# EAGLE design Indicator_voltage_TNN_V1.0 (EAGLE 9.6.2)
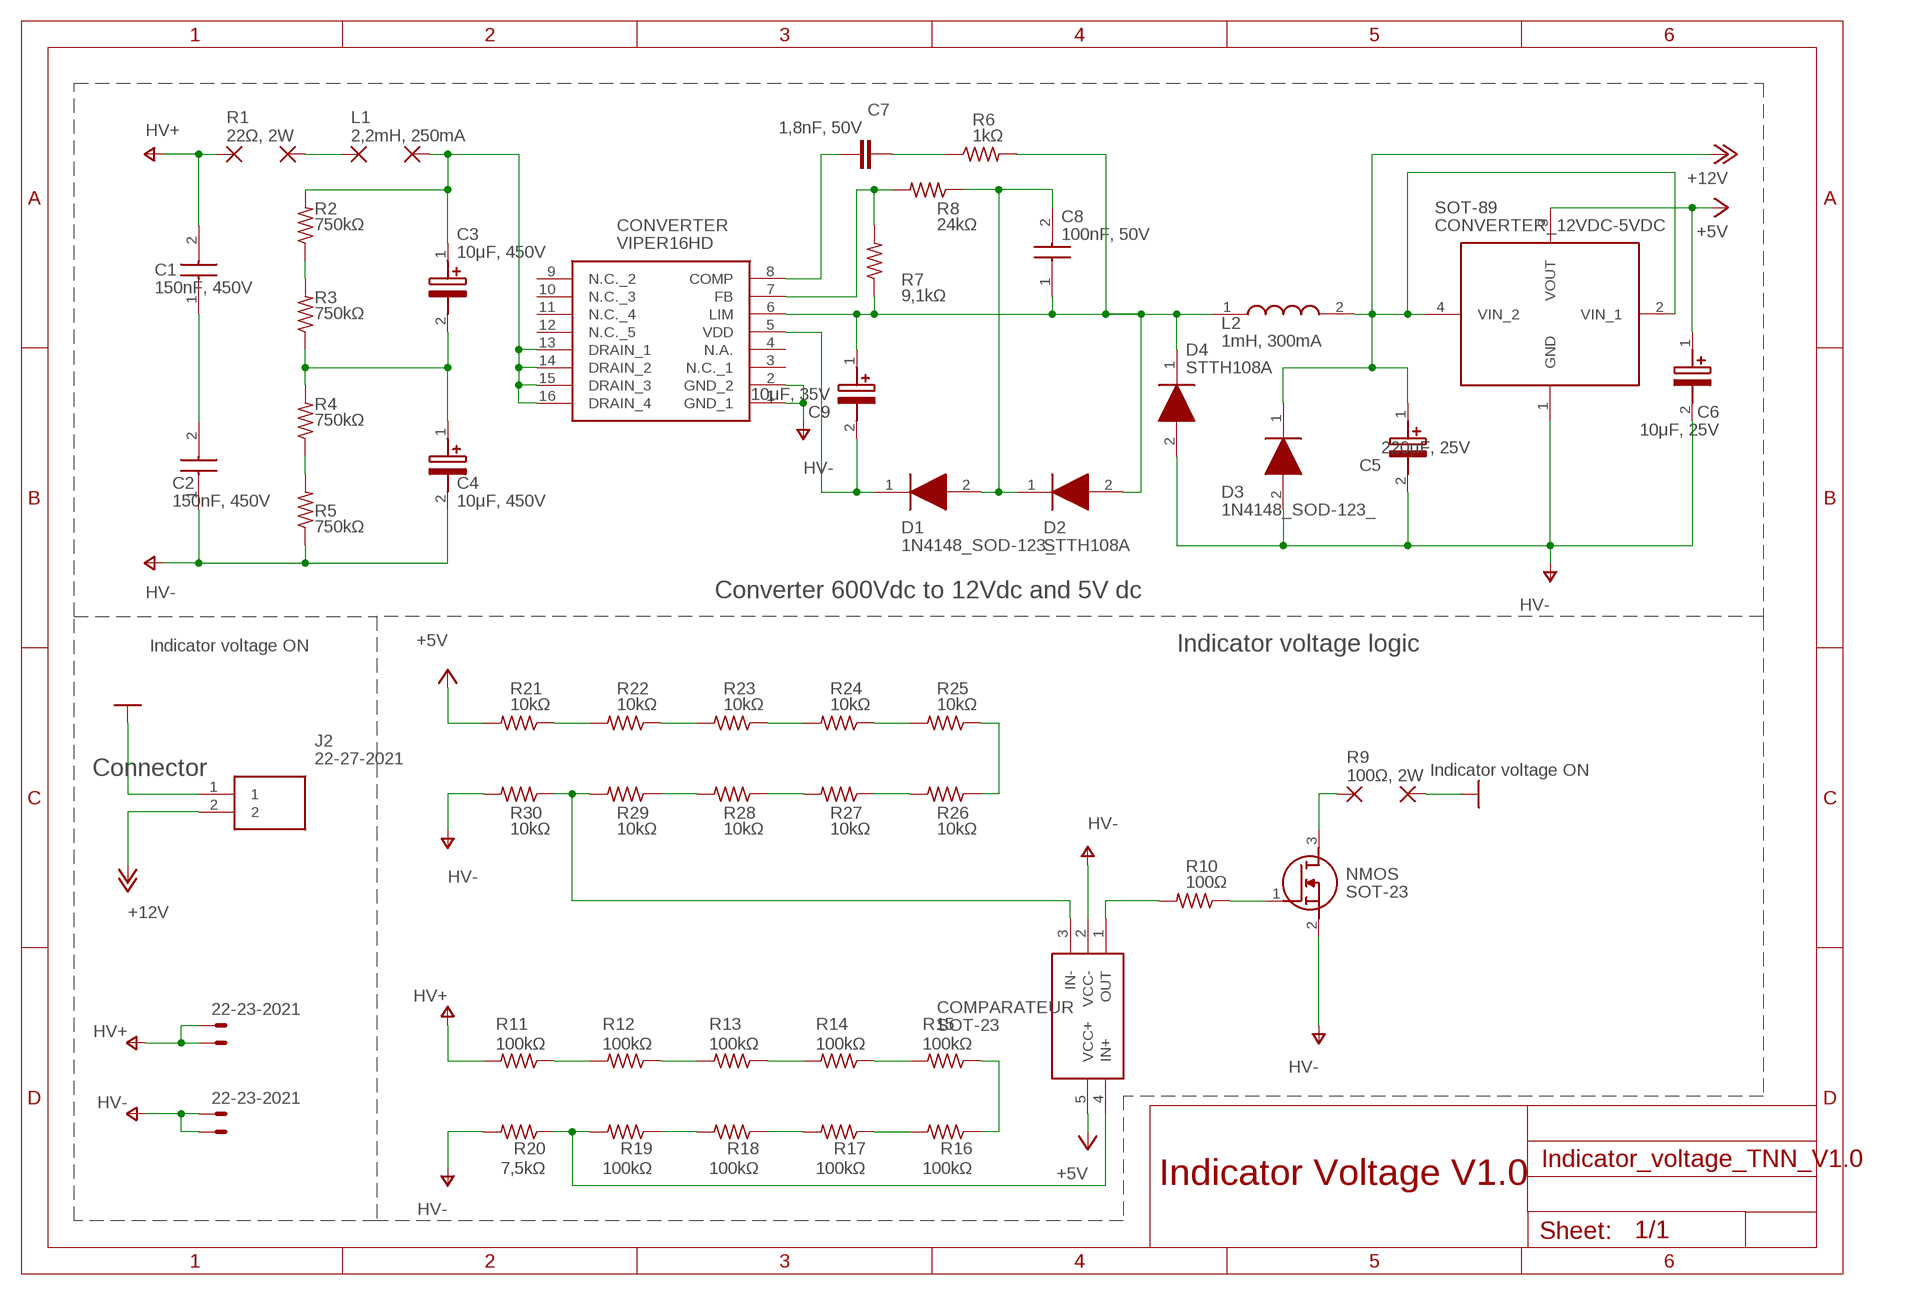
[diagram p0: schematic, sheet 1]

## Parts
C1  150nF, 450V  C1808W154KCRACTU  [CAPC4720X175N]
C2  150nF, 450V  C1808W154KCRACTU  [CAPC4720X175N]
C3  10μF, 450V  7112129  [CAPPRD500W60D1300H2250]
C4  10μF, 450V  7112129  [CAPPRD500W60D1300H2250]
C5  220μF, 25V  7112129  [CAPPRD500W60D1300H2250]
C6  10μF, 25V  ECA1VM100  [CAPPRD200W55D525H1200]
C7  1,8nF, 50V  C-EUC0805  [C0805]
C8  100nF, 50V  C0805C104K5RACTU  [CAPC2012X88N]
C9  10μF, 35V  ECA1VM100  [CAPPRD200W55D525H1200]
COMPARATEUR  SOT-23  TS391IYLT  [SOT95P280X145-5N]
CONVERTER  VIPER16HD  [SOIC127P600X175-16N]
CONVERTER_12VDC-5VDC  SOT-89  LDK320ADU120R  [ST-SOT-89]
D1  1N4148_SOD-123_  [SOD3716X135N]
D2  STTH108A  [DIOM5126X265N]
D3  1N4148_SOD-123_  [SOD3716X135N]
D4  STTH108A  [DIOM5126X265N]
HV+  22-23-2021  [22-23-2021]
HV-  22-23-2021  [22-23-2021]
J2  22-27-2021  [SHDR2W64P0X254_1X2_508X580X117]
L1  2,2mH, 250mA  1,6/0,8  [1,6/0,8]
L2  1mH, 300mA  RLB0914-102KL  [RLB0914]
L3  2,2mH, 250mA  1,6/0,8  [1,6/0,8]
NMOS  SOT-23  DMN2041L-7  [SOT96P240X110-3N]
PAD2  1,6/0,8  [1,6/0,8]
PAD4  1,6/0,8  [1,6/0,8]
R1  22Ω, 2W  1,6/0,8  [1,6/0,8]
R2  750kΩ  R-US_M3216  [M3216]
R3  750kΩ  R-US_M3216  [M3216]
R4  750kΩ  R-US_M3216  [M3216]
R5  750kΩ  R-US_M3216  [M3216]
R6  1kΩ  R-US_M2012  [M2012]
R7  9,1kΩ  R-US_M2012  [M2012]
R8  24kΩ  R-US_M2012  [M2012]
R9  100Ω, 2W  1,6/0,8  [1,6/0,8]
R10  100Ω  R-US_R0603  [R0603]
R11  100kΩ  R-US_R0603  [R0603]
R12  100kΩ  R-US_R0603  [R0603]
R13  100kΩ  R-US_R0603  [R0603]
R14  100kΩ  R-US_R0603  [R0603]
R15  100kΩ  R-US_R0603  [R0603]
R16  100kΩ  R-US_R0603  [R0603]
R17  100kΩ  R-US_R0603  [R0603]
R18  100kΩ  R-US_R0603  [R0603]
R19  100kΩ  R-US_R0603  [R0603]
R20  7,5kΩ  R-US_R0603  [R0603]
R21  10kΩ  R-US_R0603  [R0603]
R22  10kΩ  R-US_R0603  [R0603]
R23  10kΩ  R-US_R0603  [R0603]
R24  10kΩ  R-US_R0603  [R0603]
R25  10kΩ  R-US_R0603  [R0603]
R26  10kΩ  R-US_R0603  [R0603]
R27  10kΩ  R-US_R0603  [R0603]
R28  10kΩ  R-US_R0603  [R0603]
R29  10kΩ  R-US_R0603  [R0603]
R30  10kΩ  R-US_R0603  [R0603]

## Nets
0V: J2.1 PAD4.1(P) ; supply symbol labelled Indicator voltage ON
+5V: C6.1(+) COMPARATEUR.5(VCC+) CONVERTER_12VDC-5VDC.3(VOUT) R21.2
+12V: C5.1(+) CONVERTER_12VDC-5VDC.2(VIN_1) CONVERTER_12VDC-5VDC.4(VIN_2) D3.1(K) J2.2 L2.2
N$1: R11.1 R12.2
N$2: L1.1(P) PAD2.1(P)
N$3: C9.2(-) CONVERTER.5(VDD) D1.1(K)
N$4: C1.1 C2.2
N$5: C3.1(+) CONVERTER.13(DRAIN_1) CONVERTER.14(DRAIN_2) CONVERTER.15(DRAIN_3) CONVERTER.16(DRAIN_4) L3.1(P) R2.2
N$6: R4.1 R5.2
N$7: C3.2(-) C4.1(+) R3.1 R4.2
N$8: R2.1 R3.2
N$9: C7.2 CONVERTER.8(COMP)
N$10: C7.1 R6.1
N$11: C8.1 C9.1(+) CONVERTER.6(LIM) D2.2(A) D4.1(K) L2.1 R6.2 R7.1
N$12: C8.2 D1.2(A) D2.1(K) R8.1
N$13: R12.1 R13.2
N$14: CONVERTER.7(FB) R7.2 R8.2
N$15: R13.1 R14.2
N$16: R14.1 R15.2
N$17: R15.1 R16.1
N$18: R16.2 R17.1
N$19: R17.2 R18.1
N$20: R18.2 R19.1
N$21: COMPARATEUR.4(IN+) R19.2 R20.1
N$22: COMPARATEUR.1(OUT) R10.2
N$23: R21.1 R22.2
N$24: R22.1 R23.2
N$25: R23.1 R24.2
N$26: R24.1 R25.2
N$27: R25.1 R26.1
N$28: R26.2 R27.1
N$29: R27.2 R28.1
N$30: R28.2 R29.1
N$31: COMPARATEUR.3(IN-) R29.2 R30.1
N$32: NMOS.3(D) R9.1(P)
N$33: NMOS.1(G) R10.1
V+: C1.2 HV+.1 HV+.2 R1.1(P) R11.2 ; supply symbol labelled HV+
V-: C2.1 C4.2(-) C5.2(-) C6.2(-) COMPARATEUR.2(VCC-) CONVERTER.1(GND_1) CONVERTER.2(GND_2) CONVERTER_12VDC-5VDC.1(GND) D3.2(A) D4.2(A) HV-.1 HV-.2 NMOS.2(S) R5.1 R20.2 R30.2 ; supply symbol labelled HV-
Unconnected: CONVERTER.3(N.C._1) CONVERTER.4(N.A.) CONVERTER.9(N.C._2) CONVERTER.10(N.C._3) CONVERTER.11(N.C._4) CONVERTER.12(N.C._5)

## Notes on the sheet
- Converter 600Vdc to 12Vdc and 5V dc
- Indicator voltage logic
- Connector
- Indicator Voltage V1.0

## Library data of the parts
C1 C2 = C1808W154KCRACTU:C1808W154KCRACTU: Kemet 1808 Arcshield HV Flex Termination 150nF Ceramic Multilayer Capacitor, 500 V dc, +125C, X7R Dielectric, +/-10% Source: Datasheet <https://datasheet.datasheetarchive.com/originals/distributors/Datasheets-DGA10/2425039.pdf>; ARROW_PART_NUMBER: C1808W154KCRACTU; ARROW_PRICE-STOCK: https://www.arrow.com/en/products/c1808w154kcractu/kemet-corporation; DESCRIPTION: Kemet 1808 Arcshield HV Flex Termination 150nF Ceramic Multilayer Capacitor, 500 V dc, +125C, X7R Dielectric, +/-10%; HEIGHT: 1.75mm; MANUFACTURER_NAME: Kemet; MANUFACTURER_PART_NUMBER: C1808W154KCRACTU; MOUSER_PART_NUMBER: 80-C1808W154KCR; MOUSER_PRICE-STOCK: https://www.mouser.co.uk/ProductDetail/KEMET/C1808W154KCRACTU?qs=Wo0SukjKc%2F90TgI1IO5RiQ%3D%3D
C3-C5 = 7112129:7112129: RS Pro 10uF 450 V dc Aluminium Electrolytic Capacitor 2000h 13 Dia. x 21mm Source: Datasheet <https://docs.rs-online.com/986c/0900766b8158177d.pdf>; DESCRIPTION: RS Pro 10uF 450 V dc Aluminium Electrolytic Capacitor 2000h 13 Dia. x 21mm; HEIGHT: 22.5mm; MANUFACTURER_NAME: RS Components; MANUFACTURER_PART_NUMBER: 7112129
C6 C9 = ECA1VM100:ECA1VM100: M radial Al elect cap,10uF 35V 85deg C Panasonic 10uF 35 V dc Aluminium Electrolytic Capacitor, M Series 2000h Source: Datasheet <http://industrial.panasonic.com/cdbs/www-data/pdf/RDF0000/ABA0000C1218.pdf>; DESCRIPTION: M radial Al elect cap,10uF 35V 85deg C Panasonic 10uF 35 V dc Aluminium Electrolytic Capacitor, M Series 2000h; HEIGHT: 12mm; MANUFACTURER_NAME: Panasonic; MANUFACTURER_PART_NUMBER: ECA1VM100
C7 = rcl:C-EU: CAPACITOR, European symbol; SPICEPREFIX: C
C8 = C0805C104K5RACTU:C0805C104K5RACTU: 0805 X7R ceramic capacitor,100nF 50V Kemet 0805 0.1 Source: Datasheet <https://datasheet.datasheetarchive.com/originals/distributors/Datasheets-DGA10/2404717.pdf>; ARROW_PART_NUMBER: C0805C104K5RACTU; ARROW_PRICE-STOCK: https://www.arrow.com/en/products/c0805c104k5ractu/kemet-corporation?region=nac; DESCRIPTION: 0805 X7R ceramic capacitor,100nF 50V Kemet 0805 0.1; HEIGHT: 0.88mm; MANUFACTURER_NAME: Kemet; MANUFACTURER_PART_NUMBER: C0805C104K5RACTU; MOUSER_PART_NUMBER: 80-C0805C104K5R; MOUSER_PRICE-STOCK: https://www.mouser.co.uk/ProductDetail/KEMET/C0805C104K5RACTU?qs=Pc30aiB8zWUISNb2Qeyxfw%3D%3D
COMPARATEUR = TS391IYLT:TS391IYLT: STMicroelectronics TS391IYLT Comparator, CMOS, DTL, ECL, TTL O/P, 1.3 ns/us, 300 ns/us +/-2 +/-36 V 5-Pin SOT-23 Source: Datasheet <http://uk.rs-online.com/web/p/products/8805490>; ARROW_PART_NUMBER: TS391IYLT; ARROW_PRICE-STOCK: https://www.arrow.com/en/products/ts391iylt/stmicroelectronics; DESCRIPTION: STMicroelectronics TS391IYLT Comparator, CMOS, DTL, ECL, TTL O/P, 1.3 ns/us, 300 ns/us +/-2 +/-36 V 5-Pin SOT-23; HEIGHT: 1.45mm; MANUFACTURER_NAME: STMicroelectronics; MANUFACTURER_PART_NUMBER: TS391IYLT; MOUSER_PART_NUMBER: 511-TS391IYLT; MOUSER_PRICE-STOCK: https://www.mouser.com/Search/Refine.aspx?Keyword=511-TS391IYLT
CONVERTER = VIPER16HD:VIPER16HD: VIPER16HD, Switching Regulator,, 16-Pin SO N Source: Datasheet <http://www.st.com/st-web-ui/static/active/en/resource/technical/document/datasheet/CD00218828.pdf>; ARROW_PART_NUMBER: VIPER16HD; ARROW_PRICE-STOCK: https://www.arrow.com/en/products/viper16hd/stmicroelectronics; DESCRIPTION: VIPER16HD, Switching Regulator,, 16-Pin SO N; HEIGHT: 1.75mm; MANUFACTURER_NAME: STMicroelectronics; MANUFACTURER_PART_NUMBER: VIPER16HD; MOUSER_PART_NUMBER: 511-VIPER16HD; MOUSER_PRICE-STOCK: https://www.mouser.co.uk/ProductDetail/STMicroelectronics/VIPER16HD?qs=5HwTSiuA5HCtj0M7xVuuNA%3D%3D
CONVERTER_12VDC-5VDC = LDK320ADU120R:LDK320ADU120R: STMICROELECTRONICS - LDK320ADU120R - LDO, FIXED, 12V, 0.2A, SOT-89-3 Source: Datasheet <http://www.st.com/content/ccc/resource/technical/document/datasheet/0e/0c/26/c9/a4/d4/4b/a1/DM00236470.pdf/files/DM00236470.pdf/jcr:content/translations/en.DM00236470.pdf>; ARROW_PART_NUMBER: LDK320ADU120R; ARROW_PRICE-STOCK: https://www.arrow.com/en/products/ldk320adu120r/stmicroelectronics?region=nac; DESCRIPTION: STMICROELECTRONICS - LDK320ADU120R - LDO, FIXED, 12V, 0.2A, SOT-89-3; HEIGHT: mm; MANUFACTURER_NAME: STMicroelectronics; MANUFACTURER_PART_NUMBER: LDK320ADU120R; MOUSER_PART_NUMBER: 511-LDK320ADU120R; MOUSER_PRICE-STOCK: https://www.mouser.co.uk/ProductDetail/STMicroelectronics/LDK320ADU120R?qs=1mbolxNpo8dj6BDqSWT9hQ%3D%3D
D1 D3 = 1N4148_SOD-123_:1N4148_SOD-123_: Small Signal Fast Switching Diode Source: Datasheet <https://docs.rs-online.com/d6a2/0900766b80df8fd1.pdf>; DESCRIPTION: Small Signal Fast Switching Diode; HEIGHT: 1.35mm; MANUFACTURER_NAME: Vishay; MANUFACTURER_PART_NUMBER: 1N4148(SOD-123)
D2 D4 = STTH108A:STTH108A: STTH108A, Fast Rectifier Diode, Switching 1A max, 800V 75ns, 2-Pin, SMA Source: Datasheet <http://www.st.com/web/en/resource/technical/document/datasheet/CD00003259.pdf>; ARROW_PART_NUMBER: STTH108A; ARROW_PRICE-STOCK: https://www.arrow.com/en/products/stth108a/stmicroelectronics; DESCRIPTION: STTH108A, Fast Rectifier Diode, Switching 1A max, 800V 75ns, 2-Pin, SMA; HEIGHT: 2.65mm; MANUFACTURER_NAME: STMicroelectronics; MANUFACTURER_PART_NUMBER: STTH108A; MOUSER_PART_NUMBER: 511-STTH108A; MOUSER_PRICE-STOCK: https://www.mouser.co.uk/ProductDetail/STMicroelectronics/STTH108A?qs=JquAdH79uraWtge35p8qAg%3D%3D
HV+ HV- = con-molex:22-23-2021: .100" (2.54mm) Center Header - 2 Pin; MF: MOLEX; MPN: 22-23-2021; OC_FARNELL: 1462926; OC_NEWARK: 25C3832
J2 = 22-27-2021:22-27-2021: Molex KK 254 6410, 2 Way, 1 Row, Straight PCB Header Source: Datasheet <https://datasheet.datasheetarchive.com/originals/distributors/SFDatasheet-1/sf-00030958.pdf>; DESCRIPTION: Molex KK 254 6410, 2 Way, 1 Row, Straight PCB Header; HEIGHT: 11.7mm; MANUFACTURER_NAME: Molex; MANUFACTURER_PART_NUMBER: 22-27-2021; MOUSER_PART_NUMBER: 538-22-27-2021; MOUSER_PRICE-STOCK: https://www.mouser.co.uk/ProductDetail/Molex/22-27-2021?qs=hSmm4fxMIuPWb6osY0uomA%3D%3D
L1 L3 PAD2 PAD4 R1 R9 = wirepad:1,6/0,8: THROUGH-HOLE PAD
L2 = RLB0914-102KL:RLB0914-102KL: Inductor THT 1mH Bourns 1000 uH +/-10% Ferrite Leaded Inductor, Max SRF:1.3MHz, Q:40, 300mA Idc, 2.1 Rdc RLB Source: Datasheet <http://www.bourns.com/docs/Product-Datasheets/rlb.pdf>; ARROW_PART_NUMBER: RLB0914-102KL; ARROW_PRICE-STOCK: https://www.arrow.com/en/products/rlb0914-102kl/bourns; DESCRIPTION: Inductor THT 1mH Bourns 1000 uH +/-10% Ferrite Leaded Inductor, Max SRF:1.3MHz, Q:40, 300mA Idc, 2.1 Rdc RLB; HEIGHT: mm; MANUFACTURER_NAME: Bourns; MANUFACTURER_PART_NUMBER: RLB0914-102KL; MOUSER_PART_NUMBER: 652-RLB0914-102KL; MOUSER_PRICE-STOCK: https://www.mouser.co.uk/ProductDetail/Bourns/RLB0914-102KL?qs=SUrgTEU5cSoXW47y1y0lkw%3D%3D
NMOS = DMN2041L-7:DMN2041L-7: Diodes Inc DMN2041L-7 N-channel MOSFET Transistor, 6.4 A, 20 V, 3-Pin SOT-23 Source: Datasheet <https://datasheet.datasheetarchive.com/originals/distributors/Datasheets-DGA23/1582050.pdf>; ARROW_PART_NUMBER: DMN2041L-7; ARROW_PRICE-STOCK: https://www.arrow.com/en/products/dmn2041l-7/diodes-incorporated?region=nac; DESCRIPTION: Diodes Inc DMN2041L-7 N-channel MOSFET Transistor, 6.4 A, 20 V, 3-Pin SOT-23; HEIGHT: 1.1mm; MANUFACTURER_NAME: Diodes Inc.; MANUFACTURER_PART_NUMBER: DMN2041L-7; MOUSER_PART_NUMBER: 621-DMN2041L-7; MOUSER_PRICE-STOCK: https://www.mouser.co.uk/ProductDetail/Diodes-Incorporated/DMN2041L-7?qs=tiksPeNXt0LSbn3jTreVOg%3D%3D
R2-R8 R10-R30 = rcl:R-US_: RESISTOR, American symbol; SPICEPREFIX: R

## Board
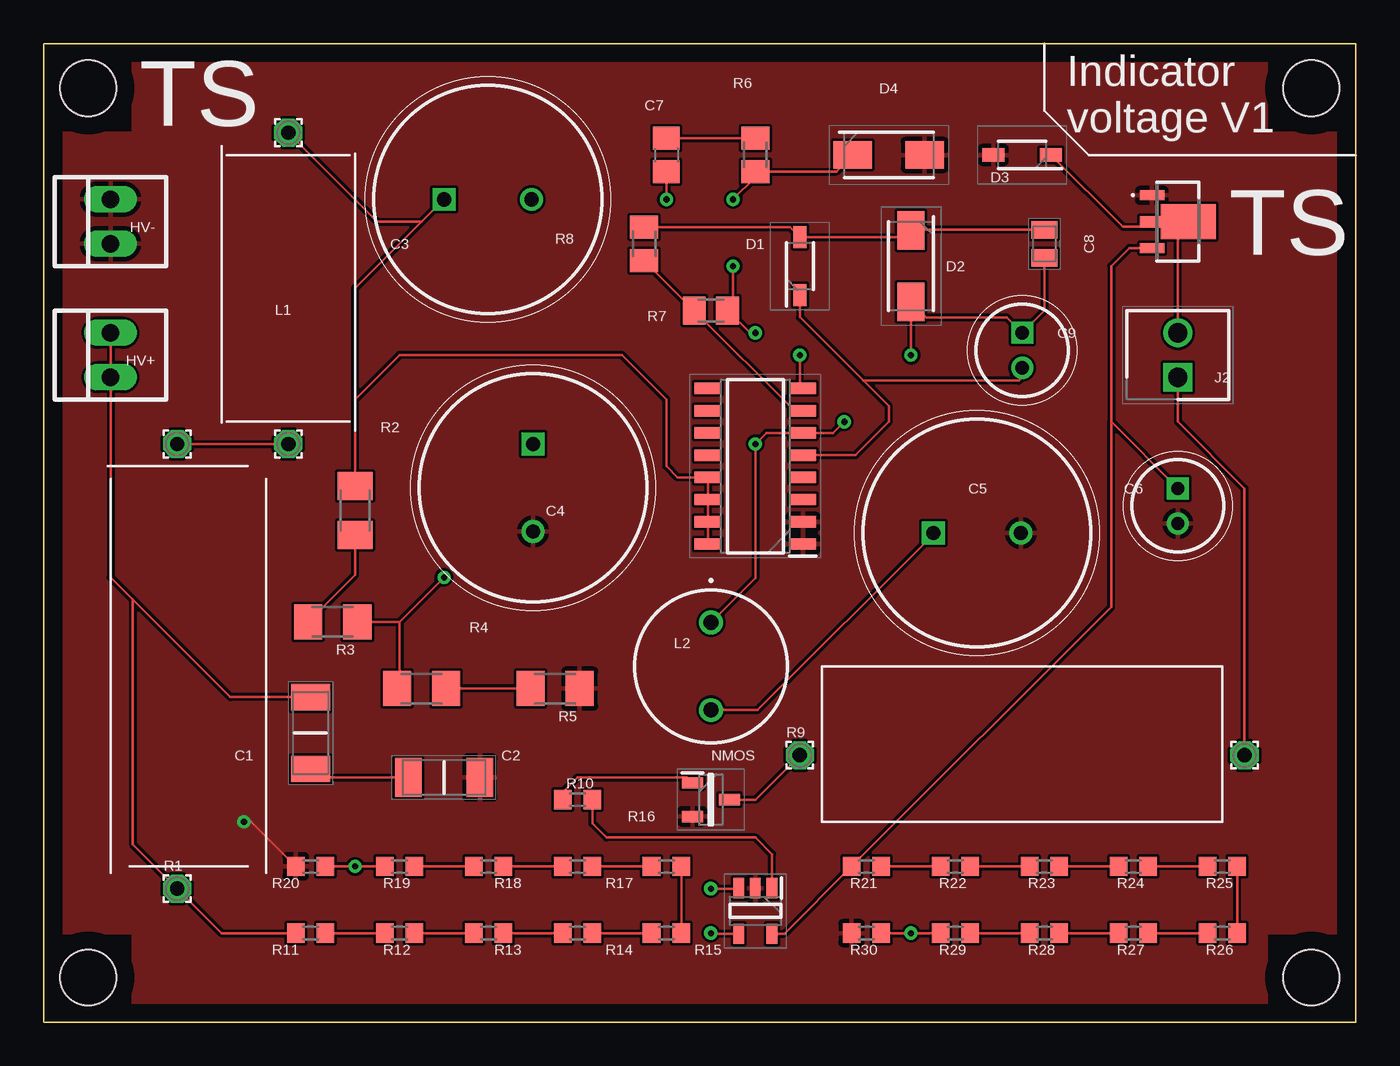
[diagram p1: board, top side]
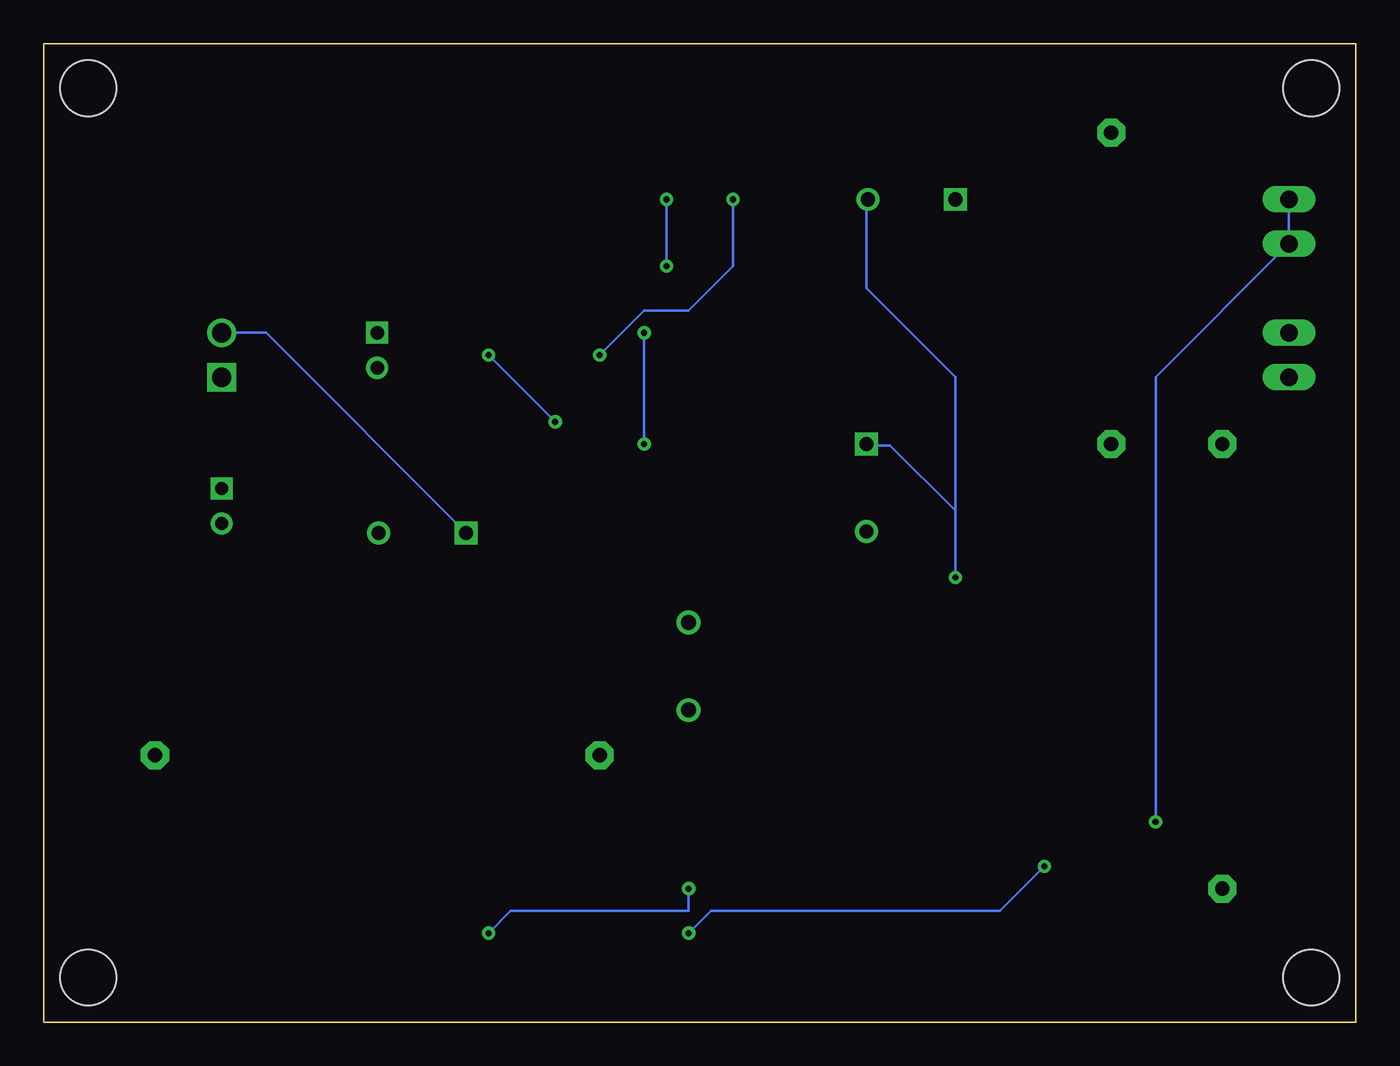
[diagram p2: board, bottom side, seen from below]

Size 74.93 x 55.88 mm. Coordinates in mm from the lower left corner, seen from the top.
Outline: 0,55.88 0,0 74.93,0 74.93,55.88 0,55.88
Copper layers (1*16): Top 0.035mm / dielectric 1.5mm / Bottom 0.035mm
Design rules "default": minimum track width 6mil, minimum drill 0.35mm, track to track 6mil, track to pad 6mil, pad to pad 6mil, via to via 6mil, smd to smd 6mil, copper to edge 40mil, drill to drill 6mil, minimum pad ring 10mil, minimum via ring 8mil, stop-mask expansion 4mil, vias tented up to drill 0mil, thermal gap 10mil
Holes 3.2 mm at 2.54,53.34 2.54,2.54 72.39,2.54 72.39,53.34

### Footprints (pad centres in the part's own frame; a part is rotated, then mirrored left to right if it is on the bottom)
CAPC4720X175N = smd 1.51 x 2.22: 1 -2.05,0; 2 2.05,0
CAPPRD500W60D1300H2250 = drill 0.8 pad 1.2 square: 1 0,0 | drill 0.8 pad 1.2: 2 5,0
CAPPRD200W55D525H1200 = drill 0.75 pad 1.15 square: 1 0,0 | drill 0.75 pad 1.15: 2 2,0
C0805 = smd 1.3 x 1.5: 1 -0.95,0; 2 0.95,0
CAPC2012X88N = smd 1.02 x 1.47: 1 -0.8,0; 2 0.8,0
SOT95P280X145-5N = smd 1.15 x 0.6: 1 -1.3,0.95; 2 -1.3,0; 3 -1.3,-0.95; 4 1.3,-0.95; 5 1.3,0.95
SOIC127P600X175-16N = smd 1.525 x 0.65: 1 -2.712,4.445; 2 -2.712,3.175; 3 -2.712,1.905; 4 -2.712,0.635; 5 -2.712,-0.635; 6 -2.712,-1.905; 7 -2.712,-3.175; 8 -2.712,-4.445; 9 2.712,-4.445; 10 2.712,-3.175; 11 2.712,-1.905; 12 2.712,-0.635; 13 2.712,0.635; 14 2.712,1.905; 15 2.712,3.175; 16 2.712,4.445
ST-SOT-89 = smd 0.57 x 1.4: 1 -1.5,-1.475; 3 1.5,-1.475 | smd 0.65 x 1.2: 2 0,-1.575 | smd 2 x 3.15: 4 0,0.6
SOD3716X135N = smd 1.25 x 0.75: 1 -1.65,0; 2 1.65,0
DIOM5126X265N = smd 2.2 x 1.55: 1 -2.05,0; 2 2.05,0
22-23-2021 = drill 1 long: 1 -1.27,0; 2 1.27,0
SHDR2W64P0X254_1X2_508X580X117 = drill 1.1 pad 1.65 square: 1 0,0 | drill 1.1 pad 1.65: 2 -2.54,0
1,6/0,8 = drill 0.813 pad 1.6 octagon: 1 0,0
RLB0914 = drill 0.85 pad 1.35: 1 -2.5,0; 2 2.5,0
SOT96P240X110-3N = smd 1.2 x 0.65: 1 -1.05,0.96; 2 -1.05,-0.96; 3 1.05,0
M3216 = smd 1.6 x 2: 1 -1.4,0; 2 1.4,0
M2012 = smd 1.3 x 1.6: 1 -0.95,0; 2 0.95,0
R0603 = smd 1 x 1.1: 1 -0.85,0; 2 0.85,0

### Placement (x,y rotation side)
C1  15.24,16.51 90 top
C2  22.86,13.97 180 top
C3  22.86,46.99 0 top
C4  27.94,33.02 270 top
C5  50.8,27.94 0 top
C6  64.77,30.48 270 top
C7  35.56,49.53 270 top
C8  57.15,44.45 90 top
C9  55.88,39.37 270 top
COMPARATEUR  40.64,6.35 270 top
CONVERTER  40.64,31.75 180 top
CONVERTER_12VDC-5VDC  64.77,45.72 270 top
D1  43.18,43.18 90 top
D2  49.53,43.18 270 top
D3  55.88,49.53 180 top
D4  48.26,49.53 0 top
HV+  3.81,38.1 90 top
HV-  3.81,45.72 90 top
J2  64.77,36.83 270 top
L1  13.97,33.02 0 top
L2  38.1,20.32 270 top
L3  13.97,50.8 0 top
NMOS  38.1,12.7 0 top
PAD2  7.62,33.02 0 top
PAD4  68.58,15.24 0 top
R1  7.62,7.62 0 top
R2  17.78,29.21 90 top
R3  16.51,22.86 180 top
R4  21.59,19.05 180 top
R5  29.21,19.05 180 top
R6  40.64,49.53 270 top
R7  38.1,40.64 180 top
R8  34.29,44.45 270 top
R9  43.18,15.24 0 top
R10  30.48,12.7 0 top
R11  15.24,5.08 180 top
R12  20.32,5.08 180 top
R13  25.4,5.08 180 top
R14  30.48,5.08 180 top
R15  35.56,5.08 180 top
R16  35.56,8.89 180 top
R17  30.48,8.89 180 top
R18  25.4,8.89 180 top
R19  20.32,8.89 180 top
R20  15.24,8.89 180 top
R21  46.99,8.89 180 top
R22  52.07,8.89 180 top
R23  57.15,8.89 180 top
R24  62.23,8.89 180 top
R25  67.31,8.89 180 top
R26  67.31,5.08 180 top
R27  62.23,5.08 180 top
R28  57.15,5.08 180 top
R29  52.07,5.08 180 top
R30  46.99,5.08 180 top

### Tracks (layer width: path | path; a pad name or v marks a point on that pad's centre or on a via)
0V
  Top 0.152: J2.1 64.77,34.29 68.58,30.48 PAD4.1
+5V
  Top 0.152: CONVERTER_12VDC-5VDC.3 62,44.22 60.96,43.18 60.96,34.29 | 60.96,34.29 C6.1 | COMPARATEUR.5 42.3,5.05 R21.2 60.96,23.71 60.96,34.29
+12V
  Top 0.152: L2.2 40.76,17.82 50.8,27.86 C5.1 | CONVERTER_12VDC-5VDC.4 65.07,45.42 64.77,45.42 | D3.1 61.64,45.42 64.77,45.42 | J2.2 64.77,45.42 | CONVERTER_12VDC-5VDC.2 64.47,45.72 64.77,45.42
  Bottom 0.152: J2.2 62.23,39.37 C5.1
N$1
  Top 0.152: R11.1 R12.2
N$2
  Top 0.152: PAD2.1 L1.1
N$3
  Top 0.152: D1.1 43.18,40.26 46.8,36.64 | 46.8,36.64 48.26,35.18 48.26,34.29 46.36,32.38 CONVERTER.5 | 46.8,36.64 55.69,36.64 55.88,36.83 C9.2
N$4
  Top 0.152: C1.1 15.73,13.97 C2.2
N$5
  Top 0.152: R2.2 17.78,35.56 | 17.78,35.56 17.78,41.91 21.59,45.72 | 21.59,45.72 C3.1 | L3.1 19.05,45.72 21.59,45.72 | 17.78,35.56 20.32,38.1 33.02,38.1 35.56,35.56 35.56,31.75 36.2,31.12 CONVERTER.13 CONVERTER.14 CONVERTER.15 CONVERTER.16
N$6
  Top 0.152: R5.2 R4.1
N$7  (via drill 0.35)
  Top 0.152: R4.2 20.32,19.18 20.32,22.86 | R3.1 20.32,22.86 | v22.86,25.4 20.32,22.86
  Bottom 0.152: 22.86,29.21 22.86,36.83 27.94,41.91 27.94,46.91 C3.2 | 22.86,29.21 v22.86,25.4 | 22.86,29.21 26.59,32.94 27.86,32.94 C4.1
N$8
  Top 0.152: R3.2 17.78,25.53 R2.1
N$9  (via drill 0.35)
  Top 0.152: CONVERTER.8 43.18,36.37 v43.18,38.1 | C7.2 v35.56,46.99
  Bottom 0.152: v43.18,38.1 40.64,40.64 38.1,40.64 35.56,43.18 v35.56,46.99
N$10
  Top 0.152: C7.1 R6.1
N$11  (via drill 0.35)
  Top 0.152: D4.1 45.26,48.58 R6.2 40.64,48.26 v39.37,46.99 | v49.53,38.1 D2.2 50.41,40.25 55,40.25 C9.1 57.15,40.64 C8.1 | v45.72,34.29 45.09,33.66 CONVERTER.6 41.27,33.66 v40.64,33.02 40.64,25.36 L2.1 | v39.37,43.18 39.37,40.96 R7.1 40.32,39.37 v40.64,39.37
  Bottom 0.152: v45.72,34.29 v49.53,38.1 | v39.37,46.99 v39.37,43.18 | v40.64,39.37 v40.64,33.02
N$12
  Top 0.152: C8.2 49.55,45.25 D2.1 49.13,44.83 D1.2 42.61,45.4 R8.1
N$13
  Top 0.152: R12.1 R13.2
N$14
  Top 0.152: R8.2 R7.2 42.87,34.93 CONVERTER.7
N$15
  Top 0.152: R13.1 R14.2
N$16
  Top 0.152: R14.1 R15.2
N$17
  Top 0.152: R15.1 R16.1
N$18
  Top 0.152: R16.2 R17.1
N$19
  Top 0.152: R17.2 R18.1
N$20
  Top 0.152: R18.2 R19.1
N$21  (via drill 0.35)
  Top 0.152: R19.2 v17.78,8.89 R20.1 | COMPARATEUR.4 38.13,5.05 v38.1,5.08
  Bottom 0.152: v38.1,5.08 36.83,6.35 20.32,6.35 v17.78,8.89
N$22
  Top 0.152: COMPARATEUR.1 41.59,9.59 40.64,10.54 32.13,10.54 31.33,11.34 R10.2
N$23
  Top 0.152: R21.1 R22.2
N$24
  Top 0.152: R22.1 R23.2
N$25
  Top 0.152: R24.2 R23.1
N$26
  Top 0.152: R25.2 R24.1
N$27
  Top 0.152: R26.1 R25.1
N$28
  Top 0.152: R27.1 R26.2
N$29
  Top 0.152: R28.1 R27.2
N$30
  Top 0.152: R29.1 R28.2
N$31  (via drill 0.35)
  Top 0.152: R30.1 v49.53,5.08 R29.2 | COMPARATEUR.3 39.66,7.62 v38.1,7.62
  Bottom 0.152: v38.1,7.62 38.1,6.35 48.26,6.35 v49.53,5.08
N$32
  Top 0.152: R9.1 40.64,12.7 NMOS.3
N$33
  Top 0.152: R10.1 29.63,13.12 30.48,13.97 36.74,13.97 NMOS.1
V+
  Top 0.152: 5.08,24.13 5.08,10.16 R1.1 10.16,5.08 R11.2 | C1.2 10.65,18.56 5.08,24.13 | HV+.2 HV+.1 3.81,25.4 5.08,24.13
V-  (via drill 0.35)
  Top 0.152: v11.43,11.43 11.85,11.43 R20.2
  Bottom 0.152: HV-.2 HV-.1 11.43,36.83 v11.43,11.43
  pour Top: 0,50.8 5.08,50.8 5.08,55.88 69.85,55.88 69.85,50.8 74.93,50.8 74.93,5.08 69.85,5.08 69.85,0 5.08,0 5.08,5.08 0,5.08

### Text on the board
tNames: TS | Indicator / voltage V1 | TS